# EAGLE design BBS_Male (EAGLE 9.6.2)
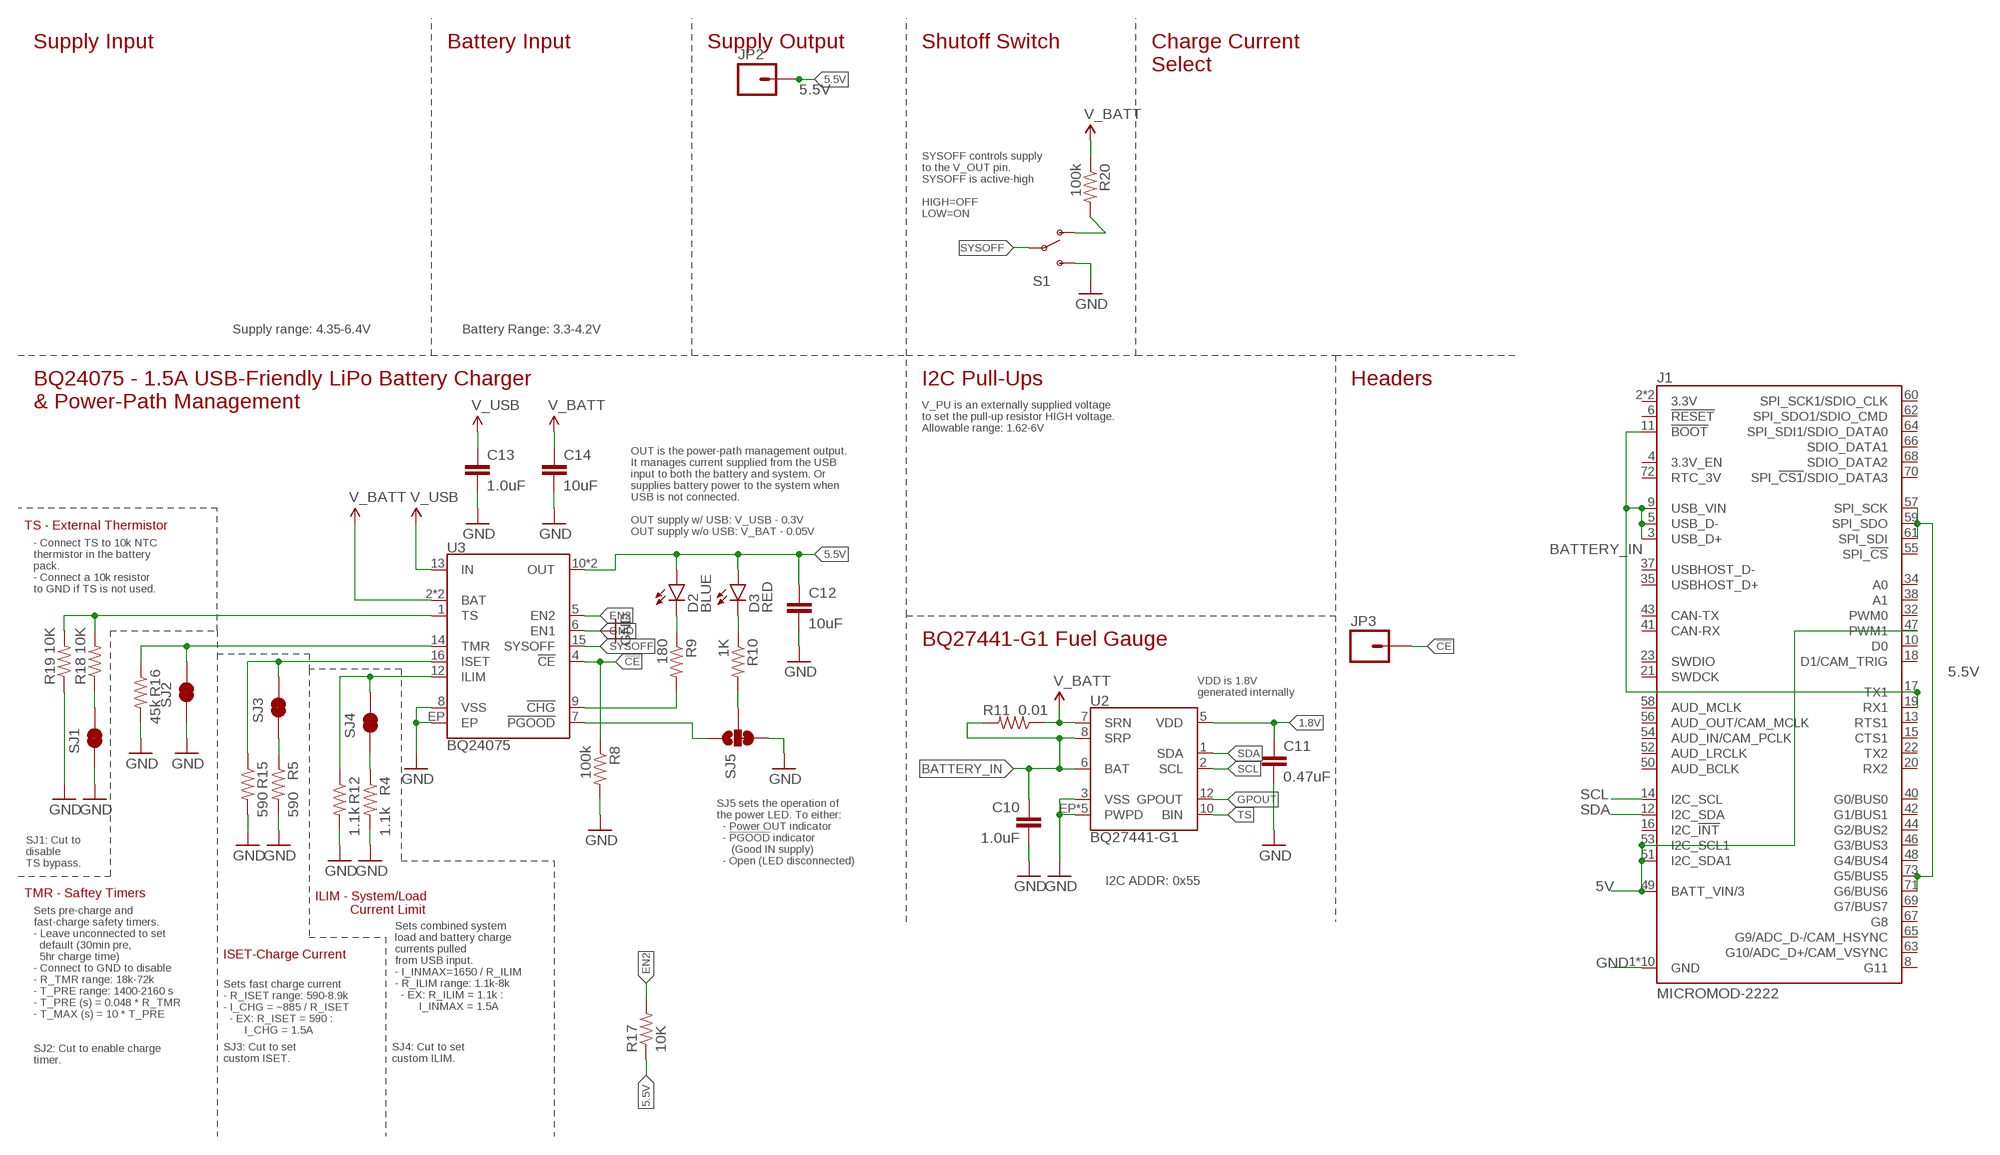
[diagram p0: schematic, sheet 1]

## Parts
C10  1.0uF  1.0UF-16V-10%(0603)  [0603-CAP]
C11  0.47uF  CAP0603-CAP  [0603-CAP]
C12  10uF  10UF10V10%(0805)  [0805-CAP]
C13  1.0uF  1.0UF50V10%(1206)  [1206-CAP]
C14  10uF  10UF10V10%(0805)  [0805-CAP]
D2  BLUE  LED-BLUE0603  [LED-0603]
D3  RED  LED-RED0603  [LED-0603]
J1  MICROMOD-2222  [M.2-CARD-E-22]
JP2  M01PTH_NO_SILK_YES_STOP  [1X01_NO_SILK]
JP3  M01PTH_NO_SILK_YES_STOP  [1X01_NO_SILK]
R4  1.1k  RESISTOR0603-RES  [0603-RES]
R5  590  RESISTOR0603-RES  [0603-RES]
R8  100k  100KOHM-1/10W-1%(0603)  [0603-RES]
R9  180  180OHM1/10W1%(0603)  [0603-RES]
R10  1K  1KOHM-1/10W-1%(0603)  [0603-RES]
R11  0.01  RESISTOR1206  [1206]
R12  1.1k  RESISTOR0603-RES  [0603-RES]
R15  590  RESISTOR0603-RES  [0603-RES]
R16  45k  RESISTOR0603-RES  [0603-RES]
R17  10K  10KOHM-1/10W-1%(0603)0603  [0603-RES]
R18  10K  10KOHM-1/10W-1%(0603)0603  [0603-RES]
R19  10K  10KOHM-1/10W-1%(0603)0603  [0603-RES]
R20  100k  100KOHM-1/10W-1%(0603)  [0603-RES]
S1  SWITCH-SPDT-SMD-A  [SWITCH-SPST-SMD-A]
SJ1  JUMPER-PAD-2-NC_BY_TRACE  [PAD-JUMPER-2-NC_BY_TRACE_YES_SILK]
SJ2  JUMPER-PAD-2-NC_BY_TRACE  [PAD-JUMPER-2-NC_BY_TRACE_YES_SILK]
SJ3  JUMPER-PAD-2-NC_BY_TRACE  [PAD-JUMPER-2-NC_BY_TRACE_YES_SILK]
SJ4  JUMPER-PAD-2-NC_BY_TRACE  [PAD-JUMPER-2-NC_BY_TRACE_YES_SILK]
SJ5  JUMPER-PAD-3-2OF3_NC_BY_TRACE_SMALL  [PAD-JUMPER-3-2OF3_NC_BY_TRACE_YES_SILK_FULL_BOX]
U2  BQ27441-G1  [PDSO-N12]
U3  BQ24075  [PVQFN-N16]

## Nets
1.8V: C11.1 U2.5(VDD)
5.5V: C12.1 D2.A D3.A J1.57(SPI_SCK) J1.59(SPI_SDO) J1.61(SPI_SDI) J1.71(G6/BUS6) J1.73(G5/BUS5) JP2.1 R17.1 U3.10(OUT) U3.11(OUT)
5V: C13.1 J1.47(PWM1) J1.49(BATT_VIN/3) J1.51(I2C_SDA1) J1.53(I2C_SCL1) U3.13(IN) ; supply symbol labelled V_USB
!CE!: JP3.1 R8.1 U3.4(!CE!)
!CHG!: R9.2 U3.9(!CHG!)
!PGOOD!: SJ5.1 U3.7(!PGOOD!)
BATTERY_IN: C10.1 J1.3(USB_D+) J1.5(USB_D-) J1.9(USB_VIN) J1.11(!BOOT!) J1.17(TX1) J1.19(RX1) R11.2 U2.6(BAT) U2.8(SRP)
EN2: R17.2 U3.5(EN2)
GND: C10.2 C11.2 C12.2 C13.2 C14.2 J1.1(GND) J1.7(GND) J1.33(GND) J1.36(GND) J1.39(GND) J1.45(GND) J1.75(GND) J1.GND1(GND) J1.GND2(GND) J1.GND3(GND) R4.2 R5.2 R8.2 R12.2 R15.2 R16.2 R19.1 S1.3(S) SJ1.1 SJ2.1 SJ5.3 U2.3(VSS) U2.EP1(PWPD) U2.EP2(PWPD) U2.EP3(PWPD) U2.EP4(PWPD) U2.EP(PWPD) U3.6(EN1) U3.8(VSS) U3.EP
GPOUT: U2.12(GPOUT)
ILIM: R12.1 SJ4.2 U3.12(ILIM)
ISET: R15.1 SJ3.2 U3.16(ISET)
N$3: R18.1 SJ1.2
N$4: R20.2 S1.1(O)
N$5: R4.1 SJ4.1
N$7: R5.1 SJ3.1
N$10: R10.2 SJ5.2
N$11: D2.C R9.1
N$12: D3.C R10.1
SCL: J1.14(I2C_SCL) U2.2(SCL)
SDA: J1.12(I2C_SDA) U2.1(SDA)
SYSOFF: S1.2(P) U3.15(SYSOFF)
TMR: R16.1 SJ2.2 U3.14(TMR)
TS: R18.2 R19.2 U2.10(BIN) U3.1(TS)
V_BATT: C14.1 R11.1 R20.1 U2.7(SRN) U3.2(BAT) U3.3(BAT)
Unconnected: J1.2(3.3V) J1.4(3.3V_EN) J1.6(!RESET!) J1.8(G11) J1.10(D0) J1.13(RTS1) J1.15(CTS1) J1.16(I2C_!INT!) J1.18(D1/CAM_TRIG) J1.20(RX2) J1.21(SWDCK) J1.22(TX2) J1.23(SWDIO) J1.32(PWM0) J1.34(A0) J1.35(USBHOST_D+) J1.37(USBHOST_D-) J1.38(A1) J1.40(G0/BUS0) J1.41(CAN-RX) J1.42(G1/BUS1) J1.43(CAN-TX) J1.44(G2/BUS2) J1.46(G3/BUS3) J1.48(G4/BUS4) J1.50(AUD_BCLK) J1.52(AUD_LRCLK) J1.54(AUD_IN/CAM_PCLK) J1.55(SPI_!CS!) J1.56(AUD_OUT/CAM_MCLK) J1.58(AUD_MCLK) J1.60(SPI_SCK1/SDIO_CLK) J1.62(SPI_SDO1/SDIO_CMD) J1.63(G10/ADC_D+/CAM_VSYNC) J1.64(SPI_SDI1/SDIO_DATA0) J1.65(G9/ADC_D-/CAM_HSYNC) J1.66(SDIO_DATA1) J1.67(G8) J1.68(SDIO_DATA2) J1.69(G7/BUS7) J1.70(SPI_!CS1!/SDIO_DATA3) J1.72(RTC_3V) J1.74(3.3V)

## Notes on the sheet
- Supply Input | Battery Input | Supply Output | Shutoff Switch
- Charge Current
  Select
- SYSOFF controls supply 
  to the V_OUT pin.
  SYSOFF is active-high
  
  HIGH=OFF
  LOW=ON
- Supply range: 4.35-6.4V | Battery Range: 3.3-4.2V
- BQ24075 - 1.5A USB-Friendly LiPo Battery Charger 
  & Power-Path Management
- I2C Pull-Ups | Headers
- V_PU is an externally supplied voltage 
  to set the pull-up resistor HIGH voltage.
  Allowable range: 1.62-6V
- OUT is the power-path management output.
  It manages current supplied from the USB 
  input to both the battery and system. Or
  supplies battery power to the system when 
  USB is not connected.
  
  OUT supply w/ USB: V_USB - 0.3V
  OUT supply w/o USB: V_BAT - 0.05V
- TS - External Thermistor
- - Connect TS to 10k NTC 
  thermistor in the battery
  pack.
  - Connect a 10k resistor 
  to GND if TS is not used.
- BQ27441-G1 Fuel Gauge
- VDD is 1.8V
  generated internally
- SJ5 sets the operation of 
  the power LED. To either:
    - Power OUT indicator
    - !PGOOD! indicator 
       (Good IN supply)
    - Open (LED disconnected)
- SJ1: Cut to 
  disable
  TS bypass.
- I2C ADDR: 0x55
- TMR - Saftey Timers
- ILIM - System/Load 
            Current Limit
- Sets pre-charge and
  fast-charge safety timers.
  - Leave unconnected to set
    default (30min pre, 
    5hr charge time)
  - Connect to GND to disable
  - R_TMR range: 18k-72k
  - T_PRE range: 1400-2160 s
  - T_PRE (s) = 0.048 * R_TMR
  - T_MAX (s) = 10 * T_PRE
- Sets combined system
  load and battery charge 
  currents pulled
  from USB input.
  - I_INMAX=1650 / R_ILIM
  - R_ILIM range: 1.1k-8k
    - EX: R_ILIM = 1.1k : 
          I_INMAX = 1.5A
- ISET-Charge Current
- Sets fast charge current
  - R_ISET range: 590-8.9k
  - I_CHG = ~885 / R_ISET
    - EX: R_ISET = 590 : 
         I_CHG = 1.5A
- SJ3: Cut to set
  custom ISET.
- SJ4: Cut to set
  custom ILIM.
- SJ2: Cut to enable charge
  timer.

## Library data of the parts
C10 = SparkFun-Capacitors:1.0UF-16V-10%(0603): CAP-00868; PROD_ID: CAP-00868
C11 = SparkFun-Capacitors:CAP: Capacitor Standard 0603 ceramic capacitor, and 0.1" leaded capacitor.; PROD_ID: CAP-13216
C12 C14 = SparkFun-Capacitors:10UF10V10%(0805): CAP-11330; PROD_ID: CAP-11330
C13 = SparkFun-Capacitors:1.0UF50V10%(1206): CAP-09822; PROD_ID: CAP-09822
D2 = SparkFun-LED:LED-BLUE: Blue LEDs for production use Various blue LEDs stocked by SparkFun production 0603 - DIO-08575 Rebel - DIO-09553 1206 - DIO-09911; PROD_ID: DIO-08575
D3 = SparkFun-LED:LED-RED: Assorted Red LEDs LilyPad 1206- DIO-09912 1206- DIO-00809 0603- DIO-00819 "SMART" means more efficient and expensive; PROD_ID: DIO-00819
J1 = SparkFun-MicroMod:MICROMOD: MicroMod Connector Description: A card edge connector and mating PCB connector to allow various MicroMod Processor Boards to be coupled with various carrier boards of different capabilities. Based on the M.2 standard.
JP2 JP3 = SparkFun-Connectors:M01: Header 1 Standard 1-pin 0.1" header. Use with straight break away headers (SKU : PRT-00116), right angle break away headers (PRT-00553), swiss pins (PRT-00743), machine pins (PRT-00117), and female headers (PRT-00115). SMTSO-256-ET is a "flush mount" nut for a 4-40 screw. The older package used to be too tight, and did not allow it to sit properly thru the drill hit. The latest (0.165DIA) fits nice and snug.
R4 R12 R16 = SparkFun-Passives:RESISTOR: Resistor Basic schematic elements and footprints for 0603, 1206, and PTH resistors.; PROD_ID: RES-10447
R5 R15 = SparkFun-Passives:RESISTOR: Resistor Basic schematic elements and footprints for 0603, 1206, and PTH resistors.; PROD_ID: RES-13217
R8 R20 = SparkFun-Resistors:100KOHM-1/10W-1%(0603): RES-07828; PROD_ID: RES-07828
R9 = SparkFun-Resistors:180OHM1/10W1%(0603): RES-08788; PROD_ID: RES-08788
R10 = SparkFun-Resistors:1KOHM-1/10W-1%(0603): RES-07856; PROD_ID: RES-07856
R11 = SparkFun-Resistors:RESISTOR: Resistor Basic schematic elements and footprints for 0603, 1206, and PTH resistors.; PROD_ID: RES-13218
R17-R19 = SparkFun-Resistors:10KOHM-1/10W-1%(0603): RES-00824; PROD_ID: RES-00824
S1 = SparkFun-Electromechanical:SWITCH-SPDT: SPDT Switch Simple slide switch, Spark Fun Electronics SKU : COM-00102 DPDT SMT slide switch, AYZ0202, SWCH-08179; PROD_ID: SWCH-10651
SJ1-SJ4 = SparkFun-Passives:JUMPER-PAD-2-NC_BY_TRACE
SJ5 = SparkFun-Passives:JUMPER-PAD-3-2OF3_NC_BY_TRACE
U2 = battery-management-temp:BQ27441-G1; PROD_ID: IC-13220
U3 = battery-management-temp:BQ24075; PROD_ID: IC-13219

## Board
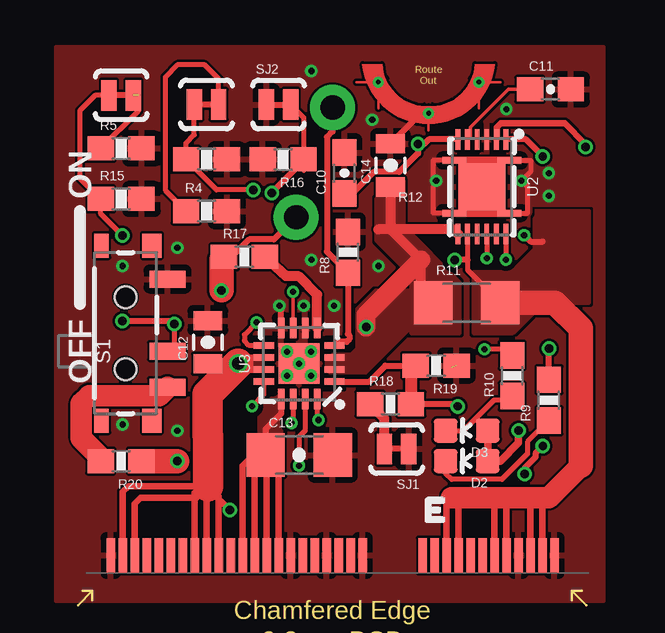
[diagram p1: board, top side]
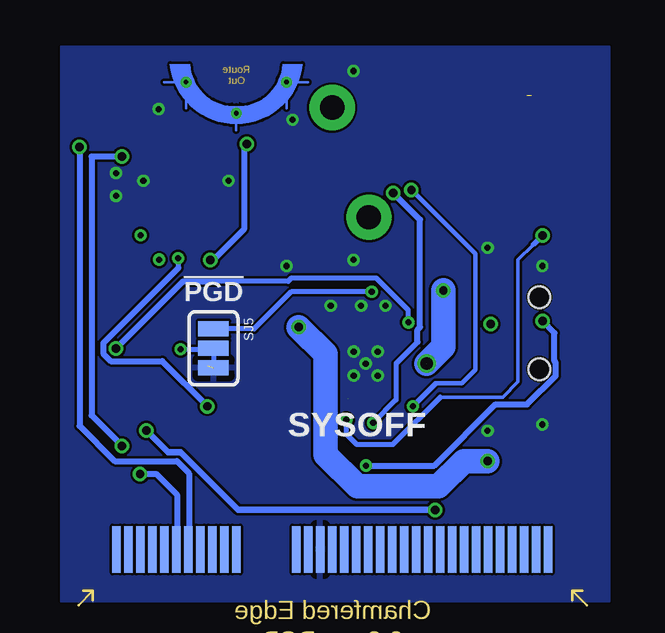
[diagram p2: board, bottom side, seen from below]

No outline drawn. Coordinates in mm, seen from the top.
Copper layers (1*16): Top 0.035mm / dielectric 1.5mm / Bottom 0.035mm
Design rules "SparkFun-2-layer-FAB-LIMIT": minimum track width 4mil, minimum drill 6mil, track to track 4mil, track to pad 4mil, pad to pad 4mil, via to via 4mil, smd to smd 4mil, copper to edge 4mil, drill to drill 4mil, minimum pad ring 5mil, minimum via ring 5mil, stop-mask expansion 4mil, vias tented up to drill 25mil, thermal gap 10mil

### Footprints (pad centres in the part's own frame; a part is rotated, then mirrored left to right if it is on the bottom)
0603-CAP = smd 1.1 x 1: 1 -0.85,0; 2 0.85,0
0805-CAP = smd 0.8 x 1.2: 1 -0.9,0; 2 0.9,0
1206-CAP = smd 1.6 x 1.8: 1 -1.4,0; 2 1.4,0
LED-0603 = smd 1 x 1: A 0,-0.877; C 0,0.877
M.2-CARD-E-22 = smd 0.35 x 1.45: 1 9.25,1.275; 3 8.75,1.275; 5 8.25,1.275; 7 7.75,1.275; 9 7.25,1.275; 11 6.75,1.275; 13 6.25,1.275; 15 5.75,1.275; 17 5.25,1.275; 19 4.75,1.275; 21 4.25,1.275; 23 3.75,1.275; 33 1.25,1.275; 35 0.75,1.275; 37 0.25,1.275; 39 -0.25,1.275; 41 -0.75,1.275; 43 -1.25,1.275; 45 -1.75,1.275; 47 -2.25,1.275; 49 -2.75,1.275; 51 -3.25,1.275; 53 -3.75,1.275; 55 -4.25,1.275; 57 -4.75,1.275; 59 -5.25,1.275; 61 -5.75,1.275; 63 -6.25,1.275; 65 -6.75,1.275; 67 -7.25,1.275; 69 -7.75,1.275; 71 -8.25,1.275; 73 -8.75,1.275; 75 -9.25,1.275 | smd 0.35 x 1.95 bottom: 2 9,1.525; 4 8.5,1.525; 6 8,1.525; 8 7.5,1.525; 10 7,1.525; 12 6.5,1.525; 14 6,1.525; 16 5.5,1.525; 18 5,1.525; 20 4.5,1.525; 22 4,1.525; 32 1.5,1.525; 34 1,1.525; 36 0.5,1.525; 38 0,1.525; 40 -0.5,1.525; 42 -1,1.525; 44 -1.5,1.525; 46 -2,1.525; 48 -2.5,1.525; 50 -3,1.525; 52 -3.5,1.525; 54 -4,1.525; 56 -4.5,1.525; 58 -5,1.525; 60 -5.5,1.525; 62 -6,1.525; 64 -6.5,1.525; 66 -7,1.525; 68 -7.5,1.525; 70 -8,1.525; 72 -8.5,1.525; 74 -9,1.525 | drill 0.2: GND1 1.9,21; GND2 4,19.7; GND3 6.1,21
1X01_NO_SILK = drill 1.016 pad 1.88: 1 0,0
0603-RES = smd 1.1 x 1: 1 -0.85,0; 2 0.85,0
1206 = smd 1.6 x 1.8: 1 -1.4,0; 2 1.4,0
SWITCH-SPST-SMD-A = smd 0.7 x 1.5: 1 -2.25,-1.75; 2 -0.75,-1.75; 3 2.25,-1.75 | smd 1 x 0.6: GND1 -3.65,1; GND3 3.65,1 | smd 1 x 0.8: GND2 -3.65,-1.1; GND4 3.65,-1.1 | hole 0.9: -1.5,0; 1.5,0
PAD-JUMPER-2-NC_BY_TRACE_YES_SILK = smd 0.635 x 1.27: 1 -0.508,0; 2 0.508,0
PAD-JUMPER-3-2OF3_NC_BY_TRACE_YES_SILK_FULL_BOX = smd 0.635 x 1.27: 1 -0.813,0; 2 0,0; 3 0.813,0
PDSO-N12 = smd 0.2 x 0.85: 1 -1,-1.975; 2 -0.6,-1.975; 3 -0.2,-1.975; 4 0.2,-1.975; 5 0.6,-1.975; 6 1,-1.975; 7 1,1.975; 8 0.6,1.975; 9 0.2,1.975; 10 -0.2,1.975; 11 -0.6,1.975; 12 -1,1.975 | smd 1.95 x 1.95: EP 0,0 | smd 1 x 0.25: EP1 -1.15,1.1; EP2 -1.15,-1.1; EP3 1.15,-1.1; EP4 1.15,1.1
PVQFN-N16 = smd 0.28 x 0.85: 1 -0.75,-1.475; 2 -0.25,-1.475; 3 0.25,-1.475; 4 0.75,-1.475; 9 0.75,1.475; 10 0.25,1.475; 11 -0.25,1.475; 12 -0.75,1.475 | smd 0.85 x 0.28: 5 1.475,-0.75; 6 1.475,-0.25; 7 1.475,0.25; 8 1.475,0.75; 13 -1.475,0.75; 14 -1.475,0.25; 15 -1.475,-0.25; 16 -1.475,-0.75 | smd 1.7 x 1.7: EP 0,0

### Placement (x,y rotation side)
C10  -24.79,16.32 90 top
C11  -16.19,19.81 0 top
C12  -30.48,9.27 90 top
C13  -26.67,4.57 0 top
C14  -22.86,16.64 90 top
D2  -19.68,4.32 90 top
D3  -19.68,5.59 90 top
J1  -25.27,-0.89 0 top
JP2  -26.8,14.48 180 top
JP3  -25.27,19.05 270 top
R4  -30.53,14.73 0 top
R5  -34.09,17.34 0 top
R8  -24.64,13.02 90 top
R9  -16.26,6.86 90 top
R10  -17.78,7.87 90 top
R11  -19.68,10.92 0 top
R12  -30.53,16.89 0 top
R15  -34.09,15.24 0 top
R16  -27.34,16.89 180 top
R17  -28.96,12.83 0 top
R18  -22.86,6.69 0 top
R19  -20.95,8.3 180 top
R20  -34.09,4.32 180 top
S1  -33.91,9.65 90 top
SJ1  -22.61,4.83 180 top
SJ2  -27.53,19.18 0 top
SJ3  -34.09,19.56 180 top
SJ4  -30.53,19.18 180 top
SJ5  -20.32,9.02 270 bottom
U2  -19.05,15.75 180 top
U3  -26.67,8.38 90 top

### Tracks (layer width: path | path; a pad name or v marks a point on that pad's centre or on a via)
1.8V
  Top 0.152: U2.5 -19.53,17.84 -19.53,18.22 -17.94,19.81 C11.1
5.5V  (via drill 0.35, 0.51)  (1 unrouted)
  Top 0.152: C12.1 v-29.22,8.37 v-29.21,8.38
  Top 0.254: JP2.1 -27.72,13.56 -28.75,13.56 -29.58,12.72 -29.91,12.72
  Top 0.279: U3.11 -28.96,8.13 v-29.21,8.38 -28.96,8.63 U3.10 | -30.46,3.28 -30.73,3.28 | -30.73,3.28 -33.78,3.28 -34.02,3.04 J1.73 | J1.71 -33.52,2.54 -33.27,2.79 -30.94,2.79 -30.52,3.21 | J1.61 -31.02,2.99 -30.73,3.28 | J1.59 -30.52,3.21 | -30.52,3.21 -30.46,3.28 | J1.57 -30.02,2.85 -30.35,3.17 | -30.35,3.17 -30.46,3.28 | v-29.57,2.29 -30.35,3.07 -30.35,3.17
  Top 0.305: v-17.53,5.59 -17.53,5.08 -18.29,4.32 D2.A D3.A
  Top 1.016: R17.1 -29.91,12.72 v-29.91,11.43
  Top 1.27: v-29.21,8.38 -30.48,7.11 -30.48,5.41 -30.46,5.38 -30.46,3.28
  Bottom 0.279: v-17.53,5.59 -18.43,4.69 -18.95,4.69 -21.35,2.29 v-29.57,2.29
  Bottom 1.016: v-29.21,8.38 -29.91,9.08 v-29.91,11.43
  pour Top (isolate 0.305, no thermals): -28.32,8 -29.27,8 -29.4,7.87 -29.21,8.76 -28.32,8.76
5V
  Top 0.254: U3.13 -27.42,6.3 -28.07,5.65 -28.07,5.08 -28.07,4.83 C13.1
  Top 0.279: J1.53 -29.02,4.13 -28.07,5.08 | J1.51 -28.52,4.12 C13.1 -28.02,4.53 J1.49 | J1.47 -27.52,4.28 -28.07,4.83
  pour Top (isolate 0.203, no thermals): -27.43,7.24 -28.32,7.24 -28.32,4.45 -27.43,5.33
!CE!
  Top 0.254: U3.4 -25.04,9.29 -24.69,9.29 -24.57,9.4 -24.57,9.56 -24.64,9.62 R8.1 -25.52,13.04 -25.52,17.81 -25.27,18.06 JP3.1
!CHG!  (via drill 0.25, 0.35)
  Top 0.203: U3.9 -28.75,9.13 -28.96,9.34 -28.96,9.59 v-28.45,10.1
  Top 0.254: R9.2 v-16.26,9.02
  Bottom 0.203: v-28.45,10.1 -28.45,10.6 -27.11,11.94 -23.56,11.94 -23.43,11.81 -20.45,11.81
  Bottom 0.254: v-16.26,9.02 -19.05,11.81 -20.45,11.81
!PGOOD!  (via drill 0.25)
  Top 0.152: U3.7 v-26.92,11.37
  Bottom 0.203: SJ5.1 -22.02,9.83 -23.56,11.37 v-26.92,11.37
BATTERY_IN  (via drill 0.25, 0.35)
  Top 0.203: U2.8 -19.65,12.7 -19.65,12.29 R11.2
  Top 0.254: v-17.29,13.73 -17.02,13.46 -16.51,13.46 | U2.6 -21.27,17.72 -21.46,17.53 v-21.72,17.53 -21.72,17.14 -22.5,16.37 -23.55,16.37 -24.45,15.47 C10.1 | -19.65,12.7 v-20.19,12.7
  Top 0.279: J1.19 -20.52,2.59 -20.32,2.79 -20.02,2.5 J1.17 | J1.11 -18.52,2.77 -18.54,2.79 | J1.9 -18.02,2.78 -18.03,2.79 | J1.5 -17.02,2.79 | J1.3 -16.52,2.53 -16.26,2.79
  Top 0.889: -14.94,4.12 -16.26,2.79 -17.02,2.79 -18.03,2.79 -18.54,2.79 -20.32,2.79
  Top 1.016: R11.2 -16,10.92 -14.94,9.86 -14.94,4.12
  Bottom 0.254: v-21.72,17.53 -21.59,17.4 -21.59,13.97 -20.45,12.83 -20.32,12.83 v-20.19,12.7
  pour Top (isolate 0.203, no thermals): -14.61,10.92 -16.51,10.92 -17.78,9.65 -19.37,9.65 -19.37,12.19 -17.78,12.19 -16.83,13.14 -16.83,14.73 -14.61,14.73
EN2
  Top 0.406: R17.2 -27.22,12.02 -26.68,12.01 -25.92,11.25 U3.5
GND  (via drill 0.25)  (1 unrouted)
  Top 0.203: U2.EP1 -17.14,14.65 -17.14,15.75 v-17.4,16 -17.02,16.38 -17.02,16.85 U2.EP2 | U2.EP4 -21.08,14.65 -21.08,15.75 -20.95,15.88 v-20.95,16 -21.08,16.13 -21.08,16.85 U2.EP3
  Top 0.254: U2.EP1 -19.05,14.65 | U3.8 -27.42,10.59
  Top 0.279: C14.2 -21.59,18.81 J1.GND2
  other vias: -23.62,18.54 -26.16,12.7 -26.67,8.38 -27.17,7.88 -27.17,8.88 -26.17,8.88 -26.17,7.88 -27.5,10.79 -16.26,15.37 -31.75,13.21 -16.26,16.32 -23.37,12.45 -18.03,18.99 -31.75,5.59 -34.04,12.45 -34.04,5.84 -26.16,20.57 -26.48,10.79 -25.21,10.79
  pour Top (rank 2): -36.83,21.59 -13.97,21.59 -13.97,-1.52 -36.83,-1.52
  pour Bottom (rank 2): -36.83,21.59 -13.97,21.59 -13.97,-1.52 -36.83,-1.52
GPOUT  (via drill 0.25)
  Top 0.203: U2.12 v-18.05,12.72
ILIM  (via drill 0.25, 0.35)
  Top 0.203: U3.12 -28.14,7.1 v-28.64,6.6 | SJ4.2 -31.04,17.91 -31.39,17.57 R12.1 -30.11,15.62 v-28.57,15.62
  Bottom 0.178: v-28.57,15.62 -31.24,12.95 -31.24,8.13 -30.67,7.56 -29.59,7.56
  Bottom 0.203: -29.59,7.56 v-28.64,6.6
ISET  (via drill 0.25, 0.35)  (1 unrouted)
  Top 0.203: U3.16 -25.92,6.1 v-25.86,6.03 | v-34.04,13.72 -34.94,14.62 R15.1 -35.81,16.11 -35.81,18.92 -35.18,19.56 SJ3.2
  Bottom 0.152: -33.66,13.34 -33.02,12.7 -33.02,7.62 -32.38,6.99 -29.78,6.99
  Bottom 0.203: -29.78,6.99 -27.81,5.02 -26.29,5.02 -25.86,5.45 v-25.86,6.03 | v-34.04,13.72 -33.66,13.34
N$3
  Top 0.254: SJ1.2 -23.18,4.76
  Top 0.406: SJ1.2 -23.11,6.09 R18.1
N$4
  Top 0.889: R20.2 -34.94,4.46 -35.76,5.28 -35.76,6.73 -35.44,7.05 -32.51,7.05 S1.1
N$5
  Top 0.203: R4.1 -32.26,15.61 -32.26,20.32 -31.75,20.83 -30.61,20.83 -30.03,20.25 SJ4.1
N$7  (1 unrouted)
  Top 0.203: R5.1 -33.38,18.91 -33.38,19.56
N$10  (via drill 0.25)
  Top 0.203: R10.2 -18.03,8.98 v-18.95,8.98
  Bottom 0.203: SJ5.2 -20.28,8.98 v-18.95,8.98
N$11
  Top 0.203: R9.1 -17.15,5.12 -17.15,4.62 -18.21,3.56 -20.32,3.56 -20.56,3.8 D2.C
N$12
  Top 0.203: R10.1 -17.95,6.86 -18.54,6.86 -19.81,5.59 D3.C
SCL  (via drill 0.35)
  Top 0.279: U2.2 -18.42,17.75 -18.42,18.22 -18.25,18.39 -15.6,18.39 -14.73,17.53 v-14.73,17.4
  Bottom 0.254: v-14.73,17.4 -14.73,5.79 -16.2,4.32 -18.8,4.32 -19.3,3.81 -19.3,0.67 J1.14
SDA  (via drill 0.35)
  Top 0.254: v-16.51,17.02 -17.21,17.72 U2.1 | v-16.51,4.95 -16.82,4.64 -16.82,4.48 -17.27,4.03 -17.27,3.8 v-17.26,3.79
  Bottom 0.254: v-16.51,17.02 -15.24,17.02 -15.24,6.22 v-16.51,4.95 | v-17.26,3.79 -17.93,3.79 -18.8,2.92 -18.8,0.66 J1.12
SYSOFF  (via drill 0.25, 0.35)
  Top 0.203: v-26.67,4.13 -26.67,5.34 -26.42,5.59 U3.15 | v-31.88,10.03 -31.88,9.18 S1.2
  Top 0.254: v-34.04,10.16 -32,10.16 v-31.88,10.03
  Bottom 0.203: v-26.67,4.13 -26.8,4
  Bottom 0.254: v-26.67,4.13 -29.53,4.13 -32.08,6.68 -33.4,6.68 -34.59,7.87 -34.59,8.43 -34.54,8.48 -34.54,9.65 v-34.04,10.16
TMR  (via drill 0.25, 0.35)
  Top 0.203: U3.14 -26.92,5.97 v-26.98,5.91 | R16.1 -26.49,16.76 -26.49,16.43 | SJ2.2 -26.49,18.64 R16.1 | -26.42,16.82 R16.1
  Top 0.254: -26.49,16.76 -26.54,16.76 v-27.81,15.49
  Bottom 0.203: v-26.98,5.91 -27.94,6.87 -27.94,8.38 -28.83,9.27
  Bottom 0.254: -28.83,9.27 -28.83,9.79 -28.93,9.9 -28.93,14.38 v-27.81,15.49
TS  (via drill 0.25, 0.35)
  Top 0.203: U2.10 v-18.85,12.77 | U3.1 -24.65,7.63
  Top 0.254: U3.1 -23.74,7.63 -23.07,8.3 R19.2 | v-20.07,6.6 -20.15,6.69 R18.2
  Top 0.508: R19.2 -22.01,8.09 R18.2
  Bottom 0.203: v-18.85,12.77 -18.85,12.38
  Bottom 0.254: -18.85,12.38 -18.85,12.36 -15.72,9.24 -15.72,8.8 -16.04,8.49 -18.18,8.49 v-20.07,6.6
V_BATT  (via drill 0.35)
  Top 0.203: R11.1 -21.21,11.05
  Top 0.406: -22.86,13.97 -23.37,13.97 | C14.1 -22.86,13.97 | U2.7 -20.25,13.97 -22.86,13.97 | R11.1 -21.59,11.43 -21.59,12.7 -22.86,13.97
  Top 0.762: v-23.88,9.91 -23.88,10.41 -21.59,12.7
  Top 1.016: R20.1 v-31.75,4.32
  Bottom 1.016: v-31.75,4.32 -30.76,4.32 -29.71,3.27 -26.32,3.27 -24.99,4.59 -24.99,8.79 v-23.88,9.91
  pour Top (isolate 0.203, no thermals): -20,9.65 -21.97,9.65 -21.97,12.06 -23.43,13.53 -23.43,15.24 -23.37,15.24 -23.37,16 -22.35,16 -22.35,14.1 -20,11.75
  pour Top (no thermals): -21.59,11.43 -23.5,11.43 -24.26,10.67 -24.26,9.02 -24.51,8.76 -25.27,8.76 -25.53,8.51 -25.53,8.13 -25.4,8 -23.88,8 -21.59,10.29

### Text on the board
tPlace: ON | OFF
bPlace: !PGD! | SYSOFF
tDocu: - 2oz Copper!